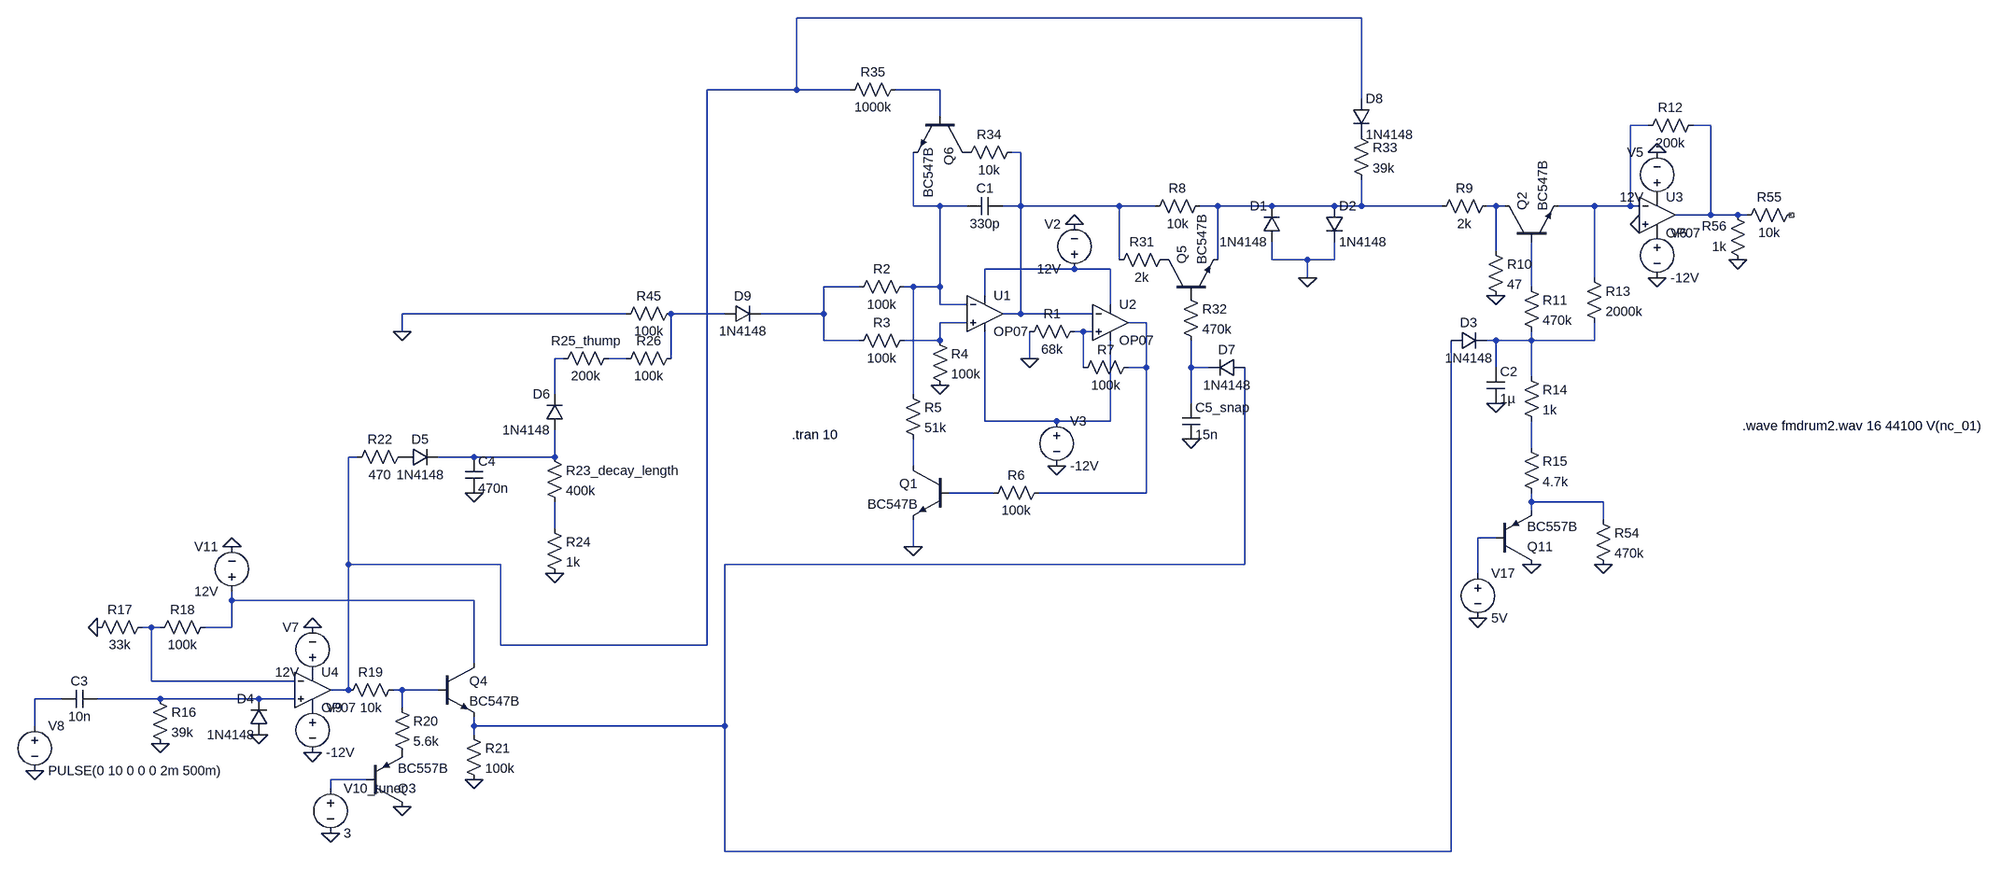
[diagram p0: schematic Drum_Synthesiser.asc]
Drum_Synthesiser.asc, the LTspice schematic file:
Version 4
SHEET 1 1932 1220
WIRE 784 -384 -224 -384
WIRE -224 -256 -224 -384
WIRE -224 -256 -384 -256
WIRE -128 -256 -224 -256
WIRE 32 -256 -48 -256
WIRE 784 -240 784 -384
WIRE 32 -208 32 -256
WIRE 1296 -192 1264 -192
WIRE 1408 -192 1376 -192
WIRE 176 -144 160 -144
WIRE -16 -48 -16 -144
WIRE 32 -48 -16 -48
WIRE 80 -48 32 -48
WIRE 176 -48 176 -144
WIRE 176 -48 144 -48
WIRE 352 -48 176 -48
WIRE 416 -48 352 -48
WIRE 528 -48 496 -48
WIRE 624 -48 528 -48
WIRE 736 -48 624 -48
WIRE 784 -48 784 -96
WIRE 784 -48 736 -48
WIRE 928 -48 784 -48
WIRE 1024 -48 1008 -48
WIRE 1040 -48 1024 -48
WIRE 1200 -48 1136 -48
WIRE 1264 -48 1264 -192
WIRE 1264 -48 1200 -48
WIRE 1280 -48 1264 -48
WIRE 1408 -32 1408 -192
WIRE 1408 -32 1344 -32
WIRE 1456 -32 1408 -32
WIRE 1472 -32 1456 -32
WIRE 1024 32 1024 -48
WIRE 352 48 352 -48
WIRE 528 48 528 -48
WIRE 624 48 624 16
WIRE 688 48 624 48
WIRE 736 48 736 16
WIRE 736 48 688 48
WIRE 272 64 112 64
WIRE 336 64 272 64
WIRE 688 80 688 48
WIRE 1200 80 1200 -48
WIRE -112 96 -176 96
WIRE -16 96 -32 96
WIRE 32 96 32 -48
WIRE 32 96 -16 96
WIRE 1088 96 1088 16
WIRE 112 112 112 64
WIRE 32 128 32 96
WIRE 80 128 32 128
WIRE 336 128 336 64
WIRE -528 144 -928 144
WIRE -352 144 -448 144
WIRE -176 144 -176 96
WIRE -176 144 -288 144
WIRE 176 144 176 -48
WIRE 176 144 144 144
WIRE 304 144 176 144
WIRE 80 160 32 160
WIRE 400 160 368 160
WIRE -928 176 -928 144
WIRE 288 176 272 176
WIRE 304 176 288 176
WIRE -176 192 -176 144
WIRE -112 192 -176 192
WIRE 32 192 32 160
WIRE 32 192 -32 192
WIRE 1024 192 1008 192
WIRE 1088 192 1088 176
WIRE 1088 192 1024 192
WIRE 1200 192 1200 160
WIRE 1200 192 1088 192
WIRE -640 224 -656 224
WIRE -528 224 -560 224
WIRE -448 224 -448 144
WIRE 192 224 192 176
WIRE 288 240 288 176
WIRE 400 240 400 160
WIRE 400 240 368 240
WIRE 480 240 480 192
WIRE 512 240 480 240
WIRE 1024 240 1024 192
WIRE 1088 256 1088 192
WIRE -656 288 -656 224
WIRE -16 288 -16 96
WIRE 480 304 480 240
WIRE 112 336 112 176
WIRE 240 336 112 336
WIRE 336 336 336 192
WIRE 336 336 240 336
WIRE 1088 384 1088 336
WIRE -1008 400 -1024 400
WIRE -800 400 -864 400
WIRE -656 400 -656 352
WIRE -656 400 -800 400
WIRE -16 416 -16 368
WIRE 128 464 48 464
WIRE 400 464 400 240
WIRE 400 464 208 464
WIRE 1088 480 1088 464
WIRE 1216 480 1088 480
WIRE 1088 496 1088 480
WIRE 1216 512 1216 480
WIRE -656 528 -656 480
WIRE 1024 544 992 544
WIRE -16 560 -16 512
WIRE -1024 592 -1024 400
WIRE -752 592 -1024 592
WIRE 576 592 576 240
WIRE 576 592 -352 592
WIRE 992 608 992 544
WIRE -1232 656 -1232 640
WIRE -800 656 -1232 656
WIRE -1376 704 -1392 704
WIRE -1360 704 -1376 704
WIRE -1232 704 -1232 656
WIRE -1232 704 -1280 704
WIRE -752 736 -752 592
WIRE -384 736 -384 -256
WIRE -384 736 -752 736
WIRE -800 768 -800 656
WIRE -1376 800 -1376 704
WIRE -1120 800 -1376 800
WIRE -1024 816 -1024 592
WIRE -1024 816 -1056 816
WIRE -928 816 -944 816
WIRE -864 816 -928 816
WIRE -1536 832 -1584 832
WIRE -1360 832 -1472 832
WIRE -1184 832 -1360 832
WIRE -1120 832 -1184 832
WIRE -928 848 -928 816
WIRE -1584 880 -1584 832
WIRE -800 880 -800 864
WIRE -352 880 -352 592
WIRE -352 880 -800 880
WIRE -800 896 -800 880
WIRE -992 976 -1056 976
WIRE -1056 992 -1056 976
WIRE -352 1104 -352 880
WIRE 944 1104 944 192
WIRE 944 1104 -352 1104
FLAG 192 224 0
FLAG 32 272 0
FLAG -16 560 0
FLAG 688 80 0
FLAG 272 -16 0
FLAG 240 416 0
FLAG 1024 112 0
FLAG 1280 -16 0
FLAG 1312 -144 0
FLAG 1312 80 0
FLAG 1024 304 0
FLAG -1584 960 0
FLAG -1360 912 0
FLAG -1184 896 0
FLAG -1088 704 0
FLAG -1088 928 0
FLAG -1472 704 0
FLAG -928 1024 0
FLAG -800 976 0
FLAG -1056 1072 0
FLAG -1232 560 0
FLAG -800 464 0
FLAG -656 608 0
FLAG 480 368 0
FLAG -928 176 0
FLAG 1088 592 0
FLAG 1216 592 0
FLAG 992 688 0
FLAG 1456 48 0
SYMBOL res 288 160 R90
WINDOW 0 0 56 VBottom 2
WINDOW 3 32 56 VTop 2
SYMATTR InstName R1
SYMATTR Value 68k
SYMATTR SpiceLine tol=1
SYMBOL res -16 80 R90
WINDOW 0 0 56 VBottom 2
WINDOW 3 32 56 VTop 2
SYMATTR InstName R2
SYMATTR Value 100k
SYMATTR SpiceLine tol=1
SYMBOL res -16 176 R90
WINDOW 0 0 56 VBottom 2
WINDOW 3 32 56 VTop 2
SYMATTR InstName R3
SYMATTR Value 100k
SYMATTR SpiceLine tol=1
SYMBOL cap 144 -64 R90
WINDOW 0 0 32 VBottom 2
WINDOW 3 32 32 VTop 2
SYMATTR InstName C1
SYMATTR Value 330p
SYMBOL res 16 176 R0
SYMATTR InstName R4
SYMATTR Value 100k
SYMATTR SpiceLine tol=1
SYMBOL res -32 272 R0
SYMATTR InstName R5
SYMATTR Value 51k
SYMATTR SpiceLine tol=1
SYMBOL npn 48 416 M0
SYMATTR InstName Q1
SYMATTR Value BC547B
SYMBOL res 224 448 R90
WINDOW 0 0 56 VBottom 2
WINDOW 3 32 56 VTop 2
SYMATTR InstName R6
SYMATTR Value 100k
SYMATTR SpiceLine tol=1
SYMBOL res 384 224 R90
WINDOW 0 0 56 VBottom 2
WINDOW 3 32 56 VTop 2
SYMATTR InstName R7
SYMATTR Value 100k
SYMATTR SpiceLine tol=1
SYMBOL OpAmps\\OP07 112 80 R0
SYMATTR InstName U1
SYMBOL OpAmps\\OP07 336 96 R0
SYMATTR InstName U2
SYMBOL res 512 -64 R90
WINDOW 0 0 56 VBottom 2
WINDOW 3 32 56 VTop 2
SYMATTR InstName R8
SYMATTR Value 10k
SYMATTR SpiceLine tol=1
SYMBOL diode 640 16 R180
WINDOW 0 24 64 Left 2
WINDOW 3 24 0 Left 2
SYMATTR InstName D1
SYMATTR Value 1N4148
SYMBOL diode 720 -48 R0
SYMATTR InstName D2
SYMATTR Value 1N4148
SYMBOL voltage 272 80 R180
WINDOW 0 24 96 Left 2
WINDOW 3 24 16 Left 2
WINDOW 123 0 0 Left 0
WINDOW 39 0 0 Left 0
SYMATTR InstName V2
SYMATTR Value 12V
SYMBOL voltage 240 320 R0
WINDOW 123 0 0 Left 0
WINDOW 39 0 0 Left 0
SYMATTR InstName V3
SYMATTR Value -12V
SYMBOL res 1024 -64 R90
WINDOW 0 0 56 VBottom 2
WINDOW 3 32 56 VTop 2
SYMATTR InstName R9
SYMATTR Value 2k
SYMBOL npn 1040 16 R270
SYMATTR InstName Q2
SYMATTR Value BC547B
SYMBOL res 1008 16 R0
SYMATTR InstName R10
SYMATTR Value 47
SYMBOL res 1072 80 R0
SYMATTR InstName R11
SYMATTR Value 470k
SYMBOL OpAmps\\OP07 1312 -96 R0
SYMATTR InstName U3
SYMBOL res 1392 -208 R90
WINDOW 0 0 56 VBottom 2
WINDOW 3 32 56 VTop 2
SYMATTR InstName R12
SYMATTR Value 200k
SYMBOL voltage 1312 -48 R180
WINDOW 0 24 96 Left 2
WINDOW 3 24 16 Left 2
WINDOW 123 0 0 Left 0
WINDOW 39 0 0 Left 0
SYMATTR InstName V5
SYMATTR Value 12V
SYMBOL voltage 1312 -16 R0
WINDOW 123 0 0 Left 0
WINDOW 39 0 0 Left 0
SYMATTR InstName V6
SYMATTR Value -12V
SYMBOL res 1184 64 R0
SYMATTR InstName R13
SYMATTR Value 2000k
SYMBOL res 1072 240 R0
SYMATTR InstName R14
SYMATTR Value 1k
SYMBOL res 1072 368 R0
SYMATTR InstName R15
SYMATTR Value 4.7k
SYMBOL cap 1008 240 R0
SYMATTR InstName C2
SYMATTR Value 1µ
SYMBOL diode 944 208 R270
WINDOW 0 32 32 VTop 2
WINDOW 3 0 32 VBottom 2
SYMATTR InstName D3
SYMATTR Value 1N4148
SYMBOL voltage -1584 864 R0
WINDOW 123 0 0 Left 0
WINDOW 39 0 0 Left 0
SYMATTR InstName V8
SYMATTR Value PULSE(0 10 0 0 0 2m 500m)
SYMBOL cap -1472 816 R90
WINDOW 0 0 32 VBottom 2
WINDOW 3 32 32 VTop 2
SYMATTR InstName C3
SYMATTR Value 10n
SYMBOL res -1376 816 R0
SYMATTR InstName R16
SYMATTR Value 39k
SYMBOL diode -1168 896 R180
WINDOW 0 24 64 Left 2
WINDOW 3 24 0 Left 2
SYMATTR InstName D4
SYMATTR Value 1N4148
SYMBOL OpAmps\\OP07 -1088 752 R0
SYMATTR InstName U4
SYMBOL voltage -1088 800 R180
WINDOW 0 24 96 Left 2
WINDOW 3 24 16 Left 2
WINDOW 123 0 0 Left 0
WINDOW 39 0 0 Left 0
SYMATTR InstName V7
SYMATTR Value 12V
SYMBOL voltage -1088 832 R0
WINDOW 123 0 0 Left 0
WINDOW 39 0 0 Left 0
SYMATTR InstName V9
SYMATTR Value -12V
SYMBOL res -1376 688 R90
WINDOW 0 0 56 VBottom 2
WINDOW 3 32 56 VTop 2
SYMATTR InstName R17
SYMATTR Value 33k
SYMBOL res -1264 688 R90
WINDOW 0 0 56 VBottom 2
WINDOW 3 32 56 VTop 2
SYMATTR InstName R18
SYMATTR Value 100k
SYMBOL res -928 800 R90
WINDOW 0 0 56 VBottom 2
WINDOW 3 32 56 VTop 2
SYMATTR InstName R19
SYMATTR Value 10k
SYMBOL res -944 832 R0
SYMATTR InstName R20
SYMATTR Value 5.6k
SYMBOL pnp -992 1024 M180
SYMATTR InstName Q3
SYMATTR Value BC557B
SYMBOL npn -864 768 R0
SYMATTR InstName Q4
SYMATTR Value BC547B
SYMBOL res -816 880 R0
SYMATTR InstName R21
SYMATTR Value 100k
SYMBOL voltage -1056 976 R0
WINDOW 123 0 0 Left 0
WINDOW 39 0 0 Left 0
SYMATTR InstName V10_tuner
SYMATTR Value 3
SYMBOL voltage -1232 656 R180
WINDOW 0 24 96 Left 2
WINDOW 3 24 16 Left 2
WINDOW 123 0 0 Left 0
WINDOW 39 0 0 Left 0
SYMATTR InstName V11
SYMATTR Value 12V
SYMBOL res -912 384 R90
WINDOW 0 0 56 VBottom 2
WINDOW 3 32 56 VTop 2
SYMATTR InstName R22
SYMATTR Value 470
SYMBOL diode -928 416 R270
WINDOW 0 32 32 VTop 2
WINDOW 3 0 32 VBottom 2
SYMATTR InstName D5
SYMATTR Value 1N4148
SYMBOL cap -816 400 R0
SYMATTR InstName C4
SYMATTR Value 470n
SYMBOL res -672 384 R0
SYMATTR InstName R23_decay_length
SYMATTR Value 400k
SYMBOL res -672 512 R0
SYMATTR InstName R24
SYMATTR Value 1k
SYMBOL diode -640 352 R180
WINDOW 0 24 64 Left 2
WINDOW 3 24 0 Left 2
SYMATTR InstName D6
SYMATTR Value 1N4148
SYMBOL res -544 208 R90
WINDOW 0 0 56 VBottom 2
WINDOW 3 32 56 VTop 2
SYMATTR InstName R25_thump
SYMATTR Value 200k
SYMBOL res -432 208 R90
WINDOW 0 0 56 VBottom 2
WINDOW 3 32 56 VTop 2
SYMATTR InstName R26
SYMATTR Value 100k
SYMBOL res 448 32 R90
WINDOW 0 0 56 VBottom 2
WINDOW 3 32 56 VTop 2
SYMATTR InstName R31
SYMATTR Value 2k
SYMBOL npn 432 112 R270
SYMATTR InstName Q5
SYMATTR Value BC547B
SYMBOL res 464 96 R0
SYMATTR InstName R32
SYMATTR Value 470k
SYMBOL cap 464 304 R0
SYMATTR InstName C5_snap
SYMATTR Value 15n
SYMBOL diode 576 224 R90
WINDOW 0 0 32 VBottom 2
WINDOW 3 32 32 VTop 2
SYMATTR InstName D7
SYMATTR Value 1N4148
SYMBOL res 768 -192 R0
SYMATTR InstName R33
SYMATTR Value 39k
SYMBOL diode 768 -240 R0
SYMATTR InstName D8
SYMATTR Value 1N4148
SYMBOL npn 80 -208 R90
SYMATTR InstName Q6
SYMATTR Value BC547B
SYMBOL res 176 -160 R90
WINDOW 0 0 56 VBottom 2
WINDOW 3 32 56 VTop 2
SYMATTR InstName R34
SYMATTR Value 10k
SYMBOL res -32 -272 R90
WINDOW 0 0 56 VBottom 2
WINDOW 3 32 56 VTop 2
SYMATTR InstName R35
SYMATTR Value 1000k
SYMBOL diode -352 160 R270
WINDOW 0 32 32 VTop 2
WINDOW 3 0 32 VBottom 2
SYMATTR InstName D9
SYMATTR Value 1N4148
SYMBOL res -432 128 R90
WINDOW 0 0 56 VBottom 2
WINDOW 3 32 56 VTop 2
SYMATTR InstName R45
SYMATTR Value 100k
SYMBOL pnp 1024 592 M180
SYMATTR InstName Q11
SYMATTR Value BC557B
SYMBOL res 1200 496 R0
SYMATTR InstName R54
SYMATTR Value 470k
SYMBOL voltage 992 592 R0
WINDOW 123 0 0 Left 0
WINDOW 39 0 0 Left 0
SYMATTR InstName V17
SYMATTR Value 5V
SYMBOL res 1568 -48 R90
WINDOW 0 0 56 VBottom 2
WINDOW 3 32 56 VTop 2
SYMATTR InstName R55
SYMATTR Value 10k
SYMBOL res 1472 64 R180
WINDOW 0 36 76 Left 2
WINDOW 3 36 40 Left 2
SYMATTR InstName R56
SYMATTR Value 1k
TEXT -232 360 Left 2 !.tran 10
TEXT 1464 344 Left 2 !.wave fmdrum2.wav 16 44100 V(nc_01)

The netlist it stands for:
* Drum_Synthesiser.asc
R1 N015 0 68k tol=1
R2 N006 N010 100k tol=1
R3 N013 N010 100k tol=1
C1 N005 N006 330p
R4 N013 0 100k tol=1
R5 N006 N023 51k tol=1
Q1 N023 N024 0 0 BC547B
R6 N014 N024 100k tol=1
R7 N014 N015 100k tol=1
XU1 N013 N006 N009 N020 N005 LT1001  ; OP07, pins In+ In- V+ V- OUT
XU2 N015 N005 N009 N020 N014 LT1001  ; OP07, pins In+ In- V+ V- OUT
R8 N007 N005 10k tol=1
D1 0 N007 1N4148
D2 N007 0 1N4148
V2 N009 0 12V
V3 N020 0 -12V
R9 N008 N007 2k
Q2 N008 N011 N003 0 BC547B
R10 N008 0 47
R11 N011 N016 470k
XU3 0 N003 P001 P002 N004 LT1001  ; OP07, pins In+ In- V+ V- OUT
R12 N004 N003 200k
V5 P001 0 12V
V6 P002 0 -12V
R13 N003 N016 2000k
R14 N016 N021 1k
R15 N021 N025 4.7k
C2 N016 0 1µ
D3 N028 N016 1N4148
V8 N032 0 PULSE(0 10 0 0 0 2m 500m)
C3 N033 N032 10n
R16 N033 0 39k
D4 0 N033 1N4148
XU4 N033 N030 P003 P004 N001 LT1001  ; OP07, pins In+ In- V+ V- OUT
V7 P003 0 12V
V9 P004 0 -12V
R17 N030 0 33k
R18 N029 N030 100k
R19 N031 N001 10k
R20 N031 P005 5.6k
Q3 0 N034 P005 0 BC557B
Q4 N029 N031 N028 0 BC547B
R21 N028 0 100k
V10_tuner N034 0 3
V11 N029 0 12V
R22 P006 N001 470
D5 P006 N022 1N4148
C4 N022 0 470n
R23_decay_length N022 N026 400k
R24 N026 0 1k
D6 N022 N017 1N4148
R25_thump N018 N017 200k
R26 N012 N018 100k
R31 P007 N005 2k
Q5 P007 P008 N007 0 BC547B
R32 P008 N019 470k
C5_snap N019 0 15n
D7 N028 N019 1N4148
R33 P009 N007 39k
D8 N001 P009 1N4148
Q6 P010 N002 N006 0 BC547B
R34 N005 P010 10k
R35 N002 N001 1000k
D9 N012 N010 1N4148
R45 N012 0 100k
Q11 0 N027 N025 0 BC557B
R54 N025 0 470k
V17 N027 0 5V
R55 NC_01 N004 10k
R56 0 N004 1k
.model D D
.lib standard.dio
.model NPN NPN
.model PNP PNP
.lib standard.bjt
.tran 10
.wave fmdrum2.wav 16 44100 V(nc_01)
.lib LTC.lib
.backanno
.end